# Altium schematic sheet Sheet1.SchDoc
size A4
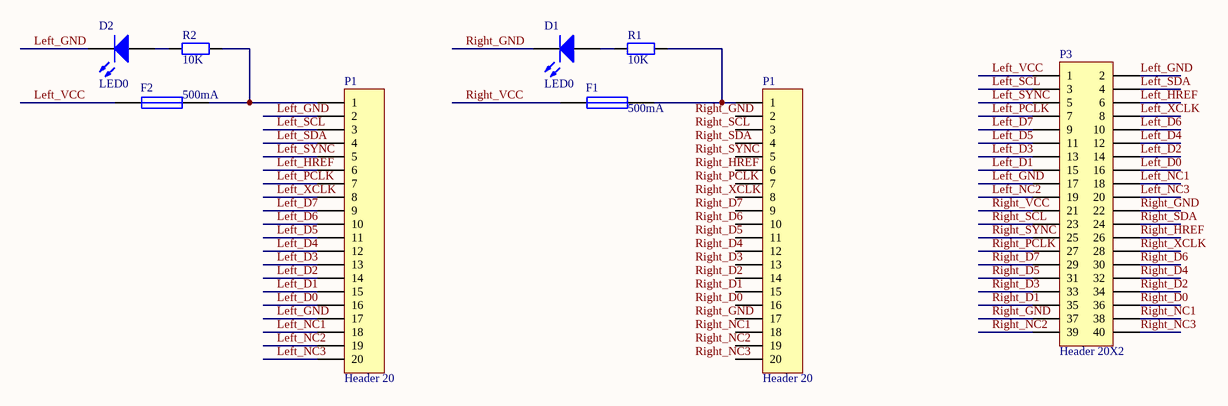
[diagram p0: Sheet1.SchDoc]

## Parts
(Parts that share a designator on the sheet are numbered #1, #2 ... from top to bottom, then left to right.)
D1  LED0  [LED0805绿]
D2  LED0  [LED0805绿]
F1  500mA  [R0805]
F2  500mA  [R0805]
P1#1  Header 20  [HDR1X20]
P1#2  Header 20  [HDR1X20]
P3  Header 20X2  [BTB0.8con40Pin]
R1  value 10K  [R0805]  (hidden comment: Res2)
R2  value 10K  [R0805]  (hidden comment: Res2)

## Nets
Left_D0: P1#1.16 P3.16
Left_D1: P1#1.15 P3.15
Left_D2: P1#1.14 P3.14
Left_D3: P1#1.13 P3.13
Left_D4: P1#1.12 P3.12
Left_D5: P1#1.11 P3.11
Left_D6: P1#1.10 P3.10
Left_D7: P1#1.9 P3.9
Left_GND: D2.2(K) P1#1.2 P1#1.17 P3.2 P3.17
Left_HREF: P1#1.6 P3.6
Left_NC1: P1#1.18 P3.18
Left_NC2: P1#1.19 P3.19
Left_NC3: P1#1.20 P3.20
Left_PCLK: P1#1.7 P3.7
Left_SCL: P1#1.3 P3.3
Left_SDA: P1#1.4 P3.4
Left_SYNC: P1#1.5 P3.5
Left_VCC: F2.1 P3.1
Left_XCLK: P1#1.8 P3.8
Right_D0: P3.36
Right_D1: P3.35
Right_D2: P3.34
Right_D3: P3.33
Right_D4: P3.32
Right_D5: P3.31
Right_D6: P3.30
Right_D7: P3.29
Right_GND: D1.2(K) P3.22 P3.37
Right_HREF: P3.26
Right_NC1: P3.38
Right_NC2: P3.39
Right_NC3: P3.40
Right_PCLK: P3.27
Right_SCL: P3.23
Right_SDA: P3.24
Right_SYNC: P3.25
Right_VCC: F1.1 P3.21
Right_XCLK: P3.28
NetD1_1: D1.1(A) R1.2
NetD2_1: D2.1(A) R2.2
NetF1_2: F1.2 P1#2.1 R1.1
NetF2_2: F2.2 P1#1.1 R2.1

Not connected (* = marked no-connect by the designer): P1#2 2 3 4 5 6 7 8 9 10 11 12 13 14 15 16 17 18 19 20

## Notes on the sheet
- Labels drawn without touching a wire or pin: Right_D0, Right_D1, Right_D2, Right_D3, Right_D4, Right_D5, Right_D6, Right_D7, Right_GND, Right_HREF, Right_NC1, Right_NC2, Right_NC3, Right_PCLK, Right_SCL, Right_SDA, Right_SYNC, Right_XCLK

## Library data of the parts
D1 D2 = LED0: Typical INFRARED GaAs LED; Published: 8-Jun-2000; LatestRevisionDate: 08-Jul-2005; LatestRevisionNote: Mech Layer 1 removed.; PackageReference: LED-0; Publisher: Altium Limited; PackageDescription: LED; 2 Leads
F1 F2 = Fuse 1: Fuse; Published: 8-Jun-2000; LatestRevisionDate: 17-Jul-2002; LatestRevisionNote: Re-released for DXP Platform.; PackageReference: PIN-W2/E2.8; Publisher: Altium Limited; PackageDescription: Thru-Hole; 2 Leads
P1#1 P1#2 = Header 20: Header, 20-Pin; LatestRevisionDate: 17-Jul-2002; LatestRevisionNote: Re-released for DXP Platform.; Publisher: Altium Limited
P3 = Header 20X2: Header, 20-Pin, Dual row; LatestRevisionDate: 17-Jul-2002; LatestRevisionNote: Re-released for DXP Platform.; Publisher: Altium Limited
R1 R2 = Res2: Resistor; Published: 8-Jun-2000; LatestRevisionDate: 17-Jul-2002; LatestRevisionNote: Re-released for DXP Platform.; PackageReference: AXIAL-0.4; Publisher: Altium Limited; PackageDescription: Axial Device, Thru-Hole; 2 Leads; 0.4 in Pin Spacing